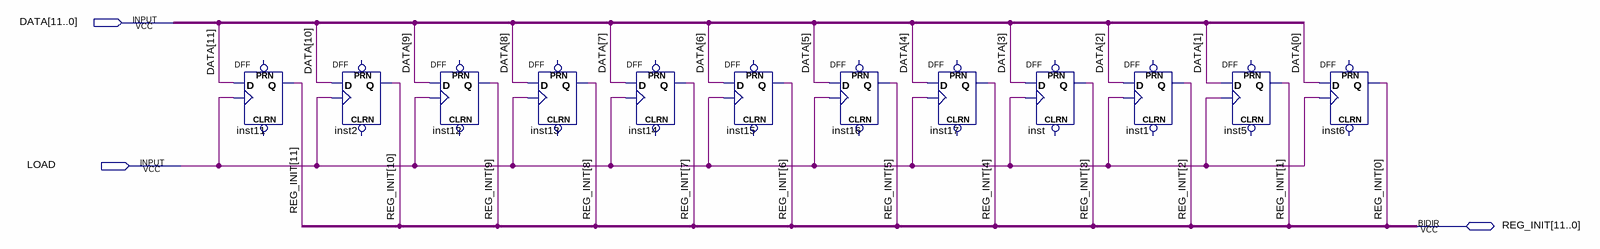
[diagram p0: schematic sheet]
// Quartus schematic registros.bdf as structural Verilog: 12 symbols, 3 pins
module registros (
  input  [11:0] DATA,
  input  LOAD,
  inout  [11:0] REG_INIT
);

  DFF inst11 (.CLK(LOAD), .D(DATA[11]), .Q(REG_INIT[11]));  // open: CLRN, PRN
  DFF inst2 (.CLK(LOAD), .D(DATA[10]), .Q(REG_INIT[10]));  // open: CLRN, PRN
  DFF inst12 (.CLK(LOAD), .D(DATA[9]), .Q(REG_INIT[9]));  // open: CLRN, PRN
  DFF inst13 (.CLK(LOAD), .D(DATA[8]), .Q(REG_INIT[8]));  // open: CLRN, PRN
  DFF inst14 (.CLK(LOAD), .D(DATA[7]), .Q(REG_INIT[7]));  // open: CLRN, PRN
  DFF inst15 (.CLK(LOAD), .D(DATA[6]), .Q(REG_INIT[6]));  // open: CLRN, PRN
  DFF inst16 (.CLK(LOAD), .D(DATA[5]), .Q(REG_INIT[5]));  // open: CLRN, PRN
  DFF inst17 (.CLK(LOAD), .D(DATA[4]), .Q(REG_INIT[4]));  // open: CLRN, PRN
  DFF inst (.CLK(LOAD), .D(DATA[3]), .Q(REG_INIT[3]));  // open: CLRN, PRN
  DFF inst1 (.CLK(LOAD), .D(DATA[2]), .Q(REG_INIT[2]));  // open: CLRN, PRN
  DFF inst5 (.CLK(LOAD), .D(DATA[1]), .Q(REG_INIT[1]));  // open: CLRN, PRN
  DFF inst6 (.CLK(LOAD), .D(DATA[0]), .Q(REG_INIT[0]));  // open: CLRN, PRN
endmodule
